# Altium schematic sheet smuc.SchDoc
size A2; Organization: HOME; Address1: L3, 12a Rodborough Rd; Address2: Frenchs Forest; Address3: NSW; Address4: Australia 2086; PageSetup: Record=PageOptions|CenterHorizontal=True|CenterVertical=True|PrintScale=0.49|XCorrection=1.00|YCorrection=1.00|PrintKind=0|BorderSize=5000000|LeftOffset=0|BottomOffset=0|Orientation=2|PaperLength=1000|PaperWidth=1000|Scale=100|PaperSource=7|PrintQuality=-3|MediaType=1|DitherType=10|PrintScaleMode=1|PaperKind=A4|PaperIndex=9
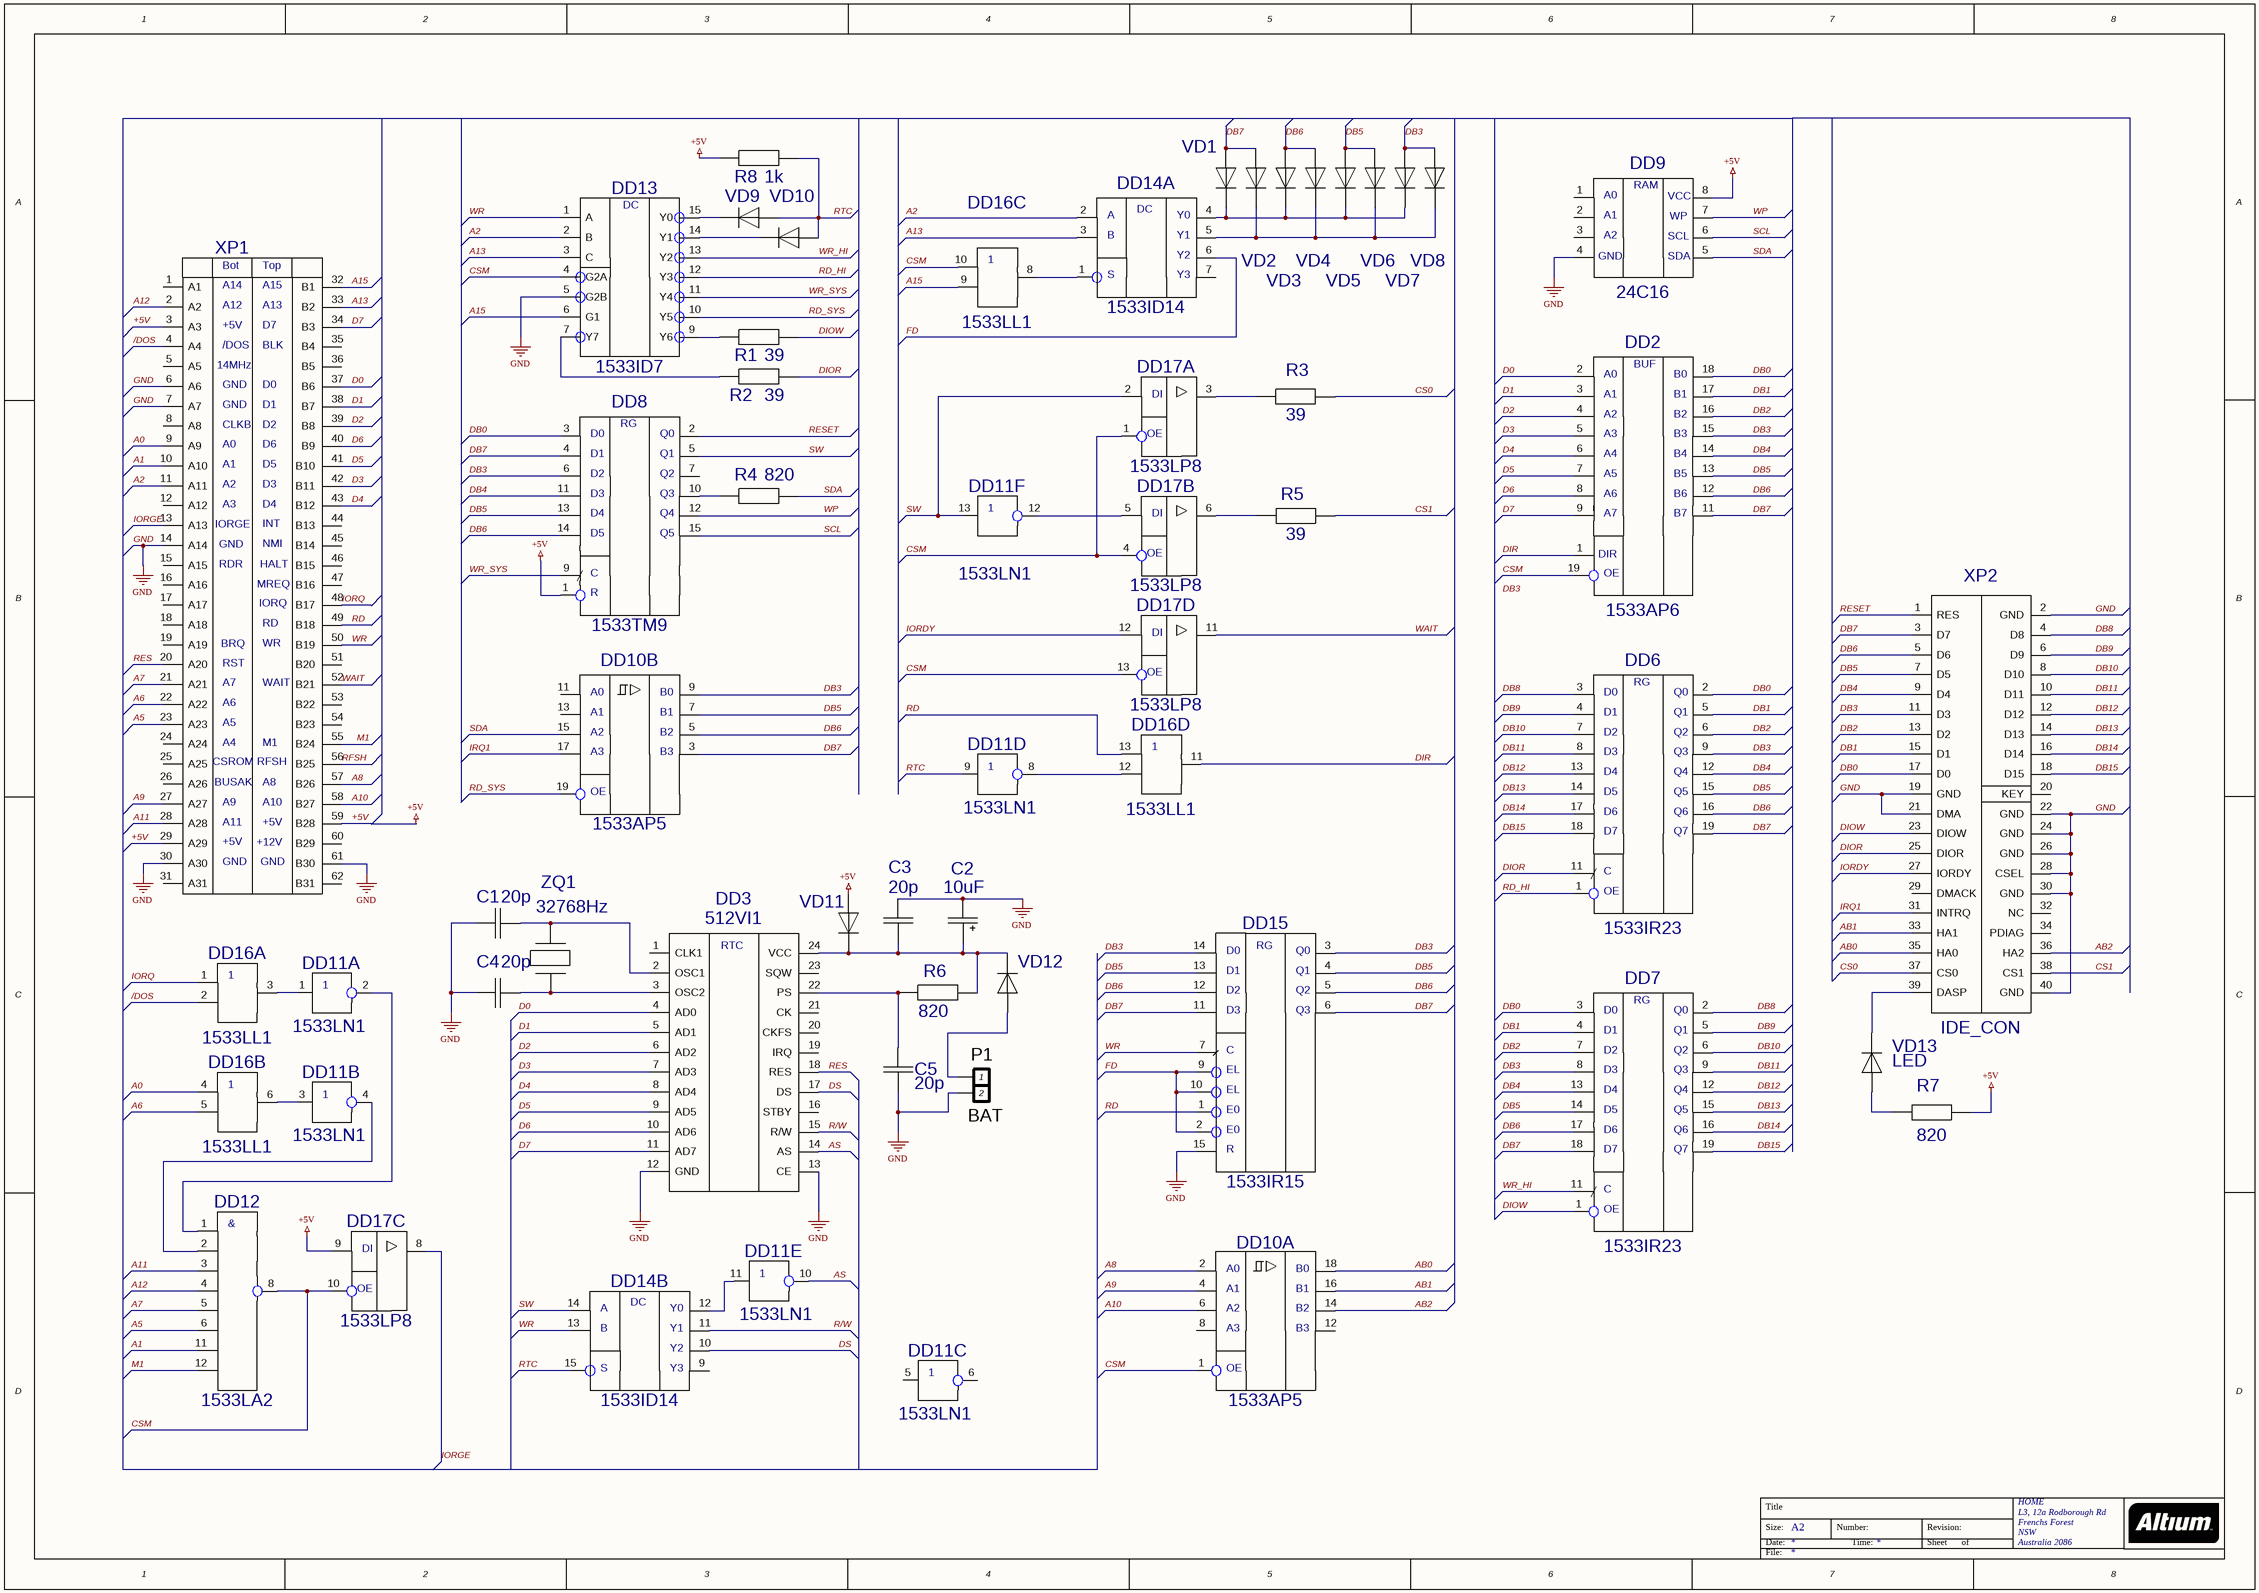
[diagram p0: smuc.SchDoc]

## Parts
C1  value 20p  [K10-17_75]  (hidden comment: K10-17_75)
C2  value 10uF  [El-d4-h7-F2.54]
C3  value 20p  [K10-17_75]  (hidden comment: K10-17_75)
C4  value 20p  [K10-17_75]  (hidden comment: K10-17_75)
C5  value 20p  [K10-17_75]  (hidden comment: K10-17_75)
DD2  1533AP6  [DIP20]
DD3  512VI1  [DIP24_15]
DD6  1533IR23  [DIP20]
DD7  1533IR23  [DIP20]
DD8  1533TM9  [DIP16]
DD9  24C16  [DIP8]
DD10  1533AP5  [DIP20]  (parts A,B of 2)
DD11  1533LN1  [DIP14]  (parts A,B,C,D,E,F of 6)
DD12  1533LA2  [DIP14]
DD13  1533ID7  [DIP16]
DD14  1533ID14  [DIP16]  (parts A,B of 2)
DD15  1533IR15  [DIP16]
DD16  1533LL1  [DIP14]  (parts A,B,C,D of 4)
DD17  1533LP8  [DIP14]  (parts A,B,C,D of 4)
P1  BAT  [BH810]
R1  value 39  [R0125-2_5]  (hidden comment: R0125-2_5)
R2  value 39  [R0125-2_5]  (hidden comment: R0125-2_5)
R3  value 39  [R0125-2_5]  (hidden comment: R0125-2_5)
R4  value 820  [R0125-2_5]  (hidden comment: R0125-2_5)
R5  value 39  [R0125-2_5]  (hidden comment: R0125-2_5)
R6  value 820  [R0125-2_5]  (hidden comment: R0125-2_5)
R7  value 820  [R0125-2_5]  (hidden comment: R0125-2_5)
R8  value 1k  [R0125-2_5]  (hidden comment: R0125-2_5)
VD1  KD522-2_5  [KD522-2_5]  (value not drawn)
VD2  KD522-2_5  [KD522-2_5]  (value not drawn)
VD3  KD522-2_5  [KD522-2_5]  (value not drawn)
VD4  KD522-2_5  [KD522-2_5]  (value not drawn)
VD5  KD522-2_5  [KD522-2_5]  (value not drawn)
VD6  KD522-2_5  [KD522-2_5]  (value not drawn)
VD7  KD522-2_5  [KD522-2_5]  (value not drawn)
VD8  KD522-2_5  [KD522-2_5]  (value not drawn)
VD9  KD522-2_5  [KD522-2_5]  (value not drawn)
VD10  KD522-2_5  [KD522-2_5]  (value not drawn)
VD11  KD522-2_5  [KD522-2_5]  (value not drawn)
VD12  KD522-2_5  [KD522-2_5]  (value not drawn)
VD13  LED  [KD522-2_5]
XP1  SCORP EDGE  [SCORPION]  (value not drawn)
XP2  IDE_CON  [IDE_CON]
ZQ1  value 32768Hz  [RK169MD]  (hidden comment: RK169MD)

## Nets
+5V: DD2.20(+5V) DD6.20(+5V) DD7.20(+5V) DD8.1(R) DD8.16(+5V) DD9.8(VCC) DD10.20(+5V) DD11.14(+5V) DD12.14(+5V) DD13.16(+5V) DD14.16(+5V) DD15.16(+5V) DD16.14(+5V) DD17.9(A) DD17.14(+5V) R7.2(B) R8.2(B) VD11.1(A) XP1.3(A3) XP1.29(A29) XP1.59(B28)
GND: C1.2(B) C2.1(A) C3.1(A) C4.2(B) C5.2(B) DD2.10(GND) DD3.12(GND) DD3.13(CE) DD6.10(GND) DD7.10(GND) DD8.8(GND) DD9.4(GND) DD10.10(GND) DD11.7(GND) DD12.7(GND) DD13.5(G2B) DD13.8(GND) DD14.8(GND) DD15.8(GND) DD15.15(R) DD16.7(GND) DD17.7(GND) P1.2 XP1.6(A6) XP1.7(A7) XP1.14(A14) XP1.30(A30) XP1.61(B30) XP2.2(GND) XP2.19(GND) XP2.21(DMA) XP2.22(GND) XP2.24(GND) XP2.26(GND) XP2.28(CSEL) XP2.30(GND) XP2.40(GND)
/DOS: DD16.2(B) XP1.4(A4)
A0: DD16.4(A) XP1.9(A9)
A1: DD12.11(G) XP1.10(A10)
A2: DD13.2(B) DD14.2(A0) XP1.11(A11)
A5: DD12.6(F) XP1.23(A23)
A6: DD16.5(B) XP1.22(A22)
A7: DD12.5(E) XP1.21(A21)
A8: DD10.2(A0) XP1.57(B26)
A9: DD10.4(A1) XP1.27(A27)
A10: DD10.6(A2) XP1.58(B27)
A11: DD12.3(C) XP1.28(A28)
A12: DD12.4(D) XP1.2(A2)
A13: DD13.3(C) DD14.3(A1) XP1.33(B2)
A15: DD13.6(G1) DD16.9(B) XP1.32(B1)
AB0: DD10.18(B0) XP2.35(HA0)
AB1: DD10.16(B1) XP2.33(HA1)
AB2: DD10.14(B2) XP2.36(HA2)
AS: DD3.14(AS) DD11.10(B)
CS0: R3.1(A) XP2.37(CS0)
CS1: R5.2(B) XP2.38(CS1)
CSM: DD2.19(E0) DD10.1(OE) DD12.8(Y) DD13.4(G2A) DD16.10(A) DD17.1(B) DD17.4(B) DD17.10(B) DD17.13(B)
D0: DD2.2(D7) DD3.4(AD0) XP1.37(B6)
D1: DD2.3(D0) DD3.5(AD1) XP1.38(B7)
D2: DD2.4(D1) DD3.6(AD2) XP1.39(B8)
D3: DD2.5(D2) DD3.7(AD3) XP1.42(B11)
D4: DD2.6(D3) DD3.8(AD4) XP1.43(B12)
D5: DD2.7(D4) DD3.9(AD5) XP1.41(B10)
D6: DD2.8(D5) DD3.10(AD6) XP1.40(B9)
D7: DD2.9(D6) DD3.11(AD7) XP1.34(B3)
DB0: DD2.18(Q0) DD6.2(Q0) DD7.3(D0) DD8.3(D0) XP2.17(D0)
DB1: DD2.17(Q1) DD6.5(Q1) DD7.4(D1) XP2.15(D1)
DB2: DD2.16(Q2) DD6.6(Q2) DD7.7(D2) XP2.13(D2)
DB3: DD2.15(Q3) DD6.9(Q3) DD7.8(D3) DD8.6(D2) DD10.9(B0) DD15.3(Q0) DD15.14(D0) VD7.1(A) VD8.1(A) XP2.11(D3)
DB4: DD2.14(Q4) DD6.12(Q4) DD7.13(D4) DD8.11(D3) XP2.9(D4)
DB5: DD2.13(Q5) DD6.15(Q5) DD7.14(D5) DD8.13(D4) DD10.7(B1) DD15.4(Q1) DD15.13(D1) VD5.1(A) VD6.1(A) XP2.7(D5)
DB6: DD2.12(Q6) DD6.16(Q6) DD7.17(D6) DD8.14(D5) DD10.5(B2) DD15.5(Q2) DD15.12(D2) VD3.1(A) VD4.1(A) XP2.5(D6)
DB7: DD2.11(Q7) DD6.19(Q7) DD7.18(D7) DD8.4(D1) DD10.3(B3) DD15.6(Q3) DD15.11(D3) VD1.1(A) VD2.1(A) XP2.3(D7)
DB8: DD6.3(D0) DD7.2(Q0) XP2.4(D8)
DB9: DD6.4(D1) DD7.5(Q1) XP2.6(D9)
DB10: DD6.7(D2) DD7.6(Q2) XP2.8(D10)
DB11: DD6.8(D3) DD7.9(Q3) XP2.10(D11)
DB12: DD6.13(D4) DD7.12(Q4) XP2.12(D12)
DB13: DD6.14(D5) DD7.15(Q5) XP2.14(D13)
DB14: DD6.17(D6) DD7.16(Q6) XP2.16(D14)
DB15: DD6.18(D7) DD7.19(Q7) XP2.18(D15)
DIOR: DD6.11(C) R2.1(A) XP2.25(DIOR)
DIOW: DD7.1(OE) R1.1(A) XP2.23(DIOW)
DIR: DD2.1(DIR) DD16.11(C)
DS: DD3.17(DS) DD14.10(B2)
FD: DD14.6(B2) DD15.2(PE) DD15.9(PE) DD15.10(PE)
IORDY: DD17.12(A) XP2.27(IORDY)
IORGE: DD17.8(C) XP1.13(A13)
IORQ: DD16.1(A) XP1.48(B17)
IRQ1: DD10.17(A3) XP2.31(INTRQ)
M1: DD12.12(H) XP1.55(B24)
R/W: DD3.15(R/W) DD14.11(B1)
RD: DD15.1(PE) DD16.13(A) XP1.49(B18)
RD_HI: DD6.1(OE) DD13.12(Y3)
RD_SYS: DD10.19(OE) DD13.10(Y5)
RES: DD3.18(RES) XP1.20(A20)
RESET: DD8.2(Q0) XP2.1(RES)
RFSH: XP1.56(B25)
RTC: DD11.9(A) DD14.15(OE) R8.1(A) VD9.1(A) VD10.1(A)
SCL: DD8.15(Q5) DD9.6(Q2)
SDA: DD9.5(Q3) DD10.15(A2) R4.1(A)
SW: DD8.5(Q1) DD11.13(A) DD14.14(A0) DD17.2(A)
WAIT: DD17.11(C) XP1.52(B21)
WP: DD8.12(Q4) DD9.7(Q1)
WR: DD13.1(A) DD14.13(A1) DD15.7(C) XP1.50(B19)
WR_HI: DD7.11(C) DD13.13(Y2)
WR_SYS: DD8.9(C) DD13.11(Y4)
NetC1_1: C1.1(A) DD3.2(OSC1) ZQ1.2(B)
NetC2_2: C2.2(B) C3.2(B) DD3.24(VCC) R6.1(A) VD11.2(B) VD12.2(B)
NetC4_1: C4.1(A) DD3.3(OSC2) ZQ1.1(A)
NetC5_1: C5.1(A) DD3.22(PS) R6.2(B)
NetDD8_10: DD8.10(Q3) R4.2(B)
NetDD11_1: DD11.1(A) DD16.3(C)
NetDD11_2: DD11.2(B) DD12.1(A)
NetDD11_3: DD11.3(A) DD16.6(C)
NetDD11_4: DD11.4(B) DD12.2(B)
NetDD11_8: DD11.8(B) DD16.12(B)
NetDD11_11: DD11.11(A) DD14.12(B0)
NetDD11_12: DD11.12(B) DD17.5(A)
NetDD13_7: DD13.7(Y7) R2.2(B)
NetDD13_9: DD13.9(Y6) R1.2(B)
NetDD13_14: DD13.14(Y1) VD10.2(B)
NetDD13_15: DD13.15(Y0) VD9.2(B)
NetDD14_1: DD14.1(OE) DD16.8(C)
NetDD14_4: DD14.4(B0) VD1.2(B) VD3.2(B) VD5.2(B) VD7.2(B)
NetDD14_5: DD14.5(B1) VD2.2(B) VD4.2(B) VD6.2(B) VD8.2(B)
NetDD17_3: DD17.3(C) R3.2(B)
NetDD17_6: DD17.6(C) R5.1(A)
NetP1_1: P1.1 VD12.1(A)
NetR7_1: R7.1(A) VD13.1(A)
NetVD13_2: VD13.2(B) XP2.39(DASP)

Not connected (* = marked no-connect by the designer): DD3 1(CLK1) 16(STBY) 19(IRQ) 20(CKFS) 21(CK) 23(SQW); DD8 7(Q2); DD9 1(A0) 2(D1) 3(D2); DD10 8(A3) 11(A0) 12(B3) 13(A1); DD11 5(A) 6(B); DD12 9 10 13; DD14 7(B3) 9(B3); XP1 1(A1) 5(A5) 8(A8) 12(A12) 15(A15) 16(A16) 17(A17) 18(A18) 19(A19) 24(A24) 25(A25) 26(A26) 31(A31) 35(B4) 36(B5) 44(B13) 45(B14) 46(B15) 47(B16) 51(B20) 53(B22) 54(B23) 60(B29) 62(B31); XP2 20(KEY) 29(DMACK) 32(NC) 34(PDIAG)

## Notes on the sheet
- Labels drawn without touching a wire or pin: DB3
- Title
- Size:
- Date:
- File:
- A2
- Number:
- Time:
- Revision:
- Sheet
- of
- (in symbol 24C16) RAM; A1; WP; A2; SCL; SDA
- (in symbol 512VI1) RTC
- (in symbol 1533AP6) BUF; A0; B0; A1; B1; A2; B2; A3; B3; A4; B4; A5; B5; A6; B6; A7; B7; OE
- (in symbol 1533ID7) DC
- (in symbol 1533ID14, part A) DC; A; Y0; B; Y1; Y2; S; Y3
- (in symbol 1533ID14, part B) DC; A; Y0; B; Y1; Y2; S; Y3
- (in symbol 1533IR15) RG; EL; E0
- (in symbol 1533IR23) RG
- (in symbol 1533LA2) &
- (in symbol 1533LP8, part A) DI; OE
- (in symbol 1533LP8, part B) DI; OE
- (in symbol 1533LP8, part C) DI; OE
- (in symbol 1533LP8, part D) DI; OE
- (in symbol 1533TM9) RG
- (in symbol SCOR EDGE) Bot; Top; +5V; D7; /DOS; BLK; 14MHz; GND; D0; D1; CLKB; D2; A0; D6; D5; D3; D4; INT; IORGE; NMI; RDR; HALT; MREQ; IORQ; RD; BRQ; WR; RST; WAIT; M1; CSROM; RFSH; BUSAK; +12V

## Library data of the parts
C2 = K50-35_75PNT: pin to pad: 1>2 2>1
P1 = Header 2
VD13 = KD522-2_5: Value: *
XP1 = SCOR EDGE: Value: *
DD2 = 1533AP6: Value: *
DD3 = 512VI1: Value: *
DD6 DD7 = 1533IR23: Value: *
DD8 = 1533TM9: Value: *
DD9 = 24C16: Value: *
DD10 = 1533AP5: Value: *
DD11 = 1533LN1: Value: *
DD12 = 1533LA2: Value: *
DD13 = 1533ID7: Value: *
DD14 = 1533ID14: Value: *
DD15 = 1533IR15: Value: *
DD16 = 1533LL1: Value: *
DD17 = 1533LP8: Value: *
VD1-VD12 = KD522-2_5: Value: *
XP2 = IDE_CON: Value: *